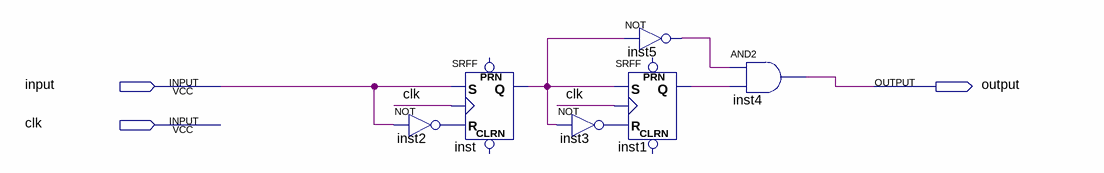
[diagram p0: schematic sheet]
// Quartus schematic FallingEdge.bdf as structural Verilog: 6 symbols, 3 pins
module FallingEdge (
  input  \input ,
  input  clk,
  output \output 
);

  wire inst1_q, inst2_out, inst3_out, inst5_out, inst_q;

  SRFF inst (.S(\input ), .R(inst2_out), .CLK(clk), .Q(inst_q));  // open: PRN, CLRN
  not inst2 (inst2_out, \input );
  not inst3 (inst3_out, inst_q);
  not inst5 (inst5_out, inst_q);
  SRFF inst1 (.S(inst_q), .R(inst3_out), .CLK(clk), .Q(inst1_q));  // open: PRN, CLRN
  and inst4 (\output , inst5_out, inst1_q);
endmodule
